# EAGLE design DavidHouseBusinessCardv1 (EAGLE 9.3.1)
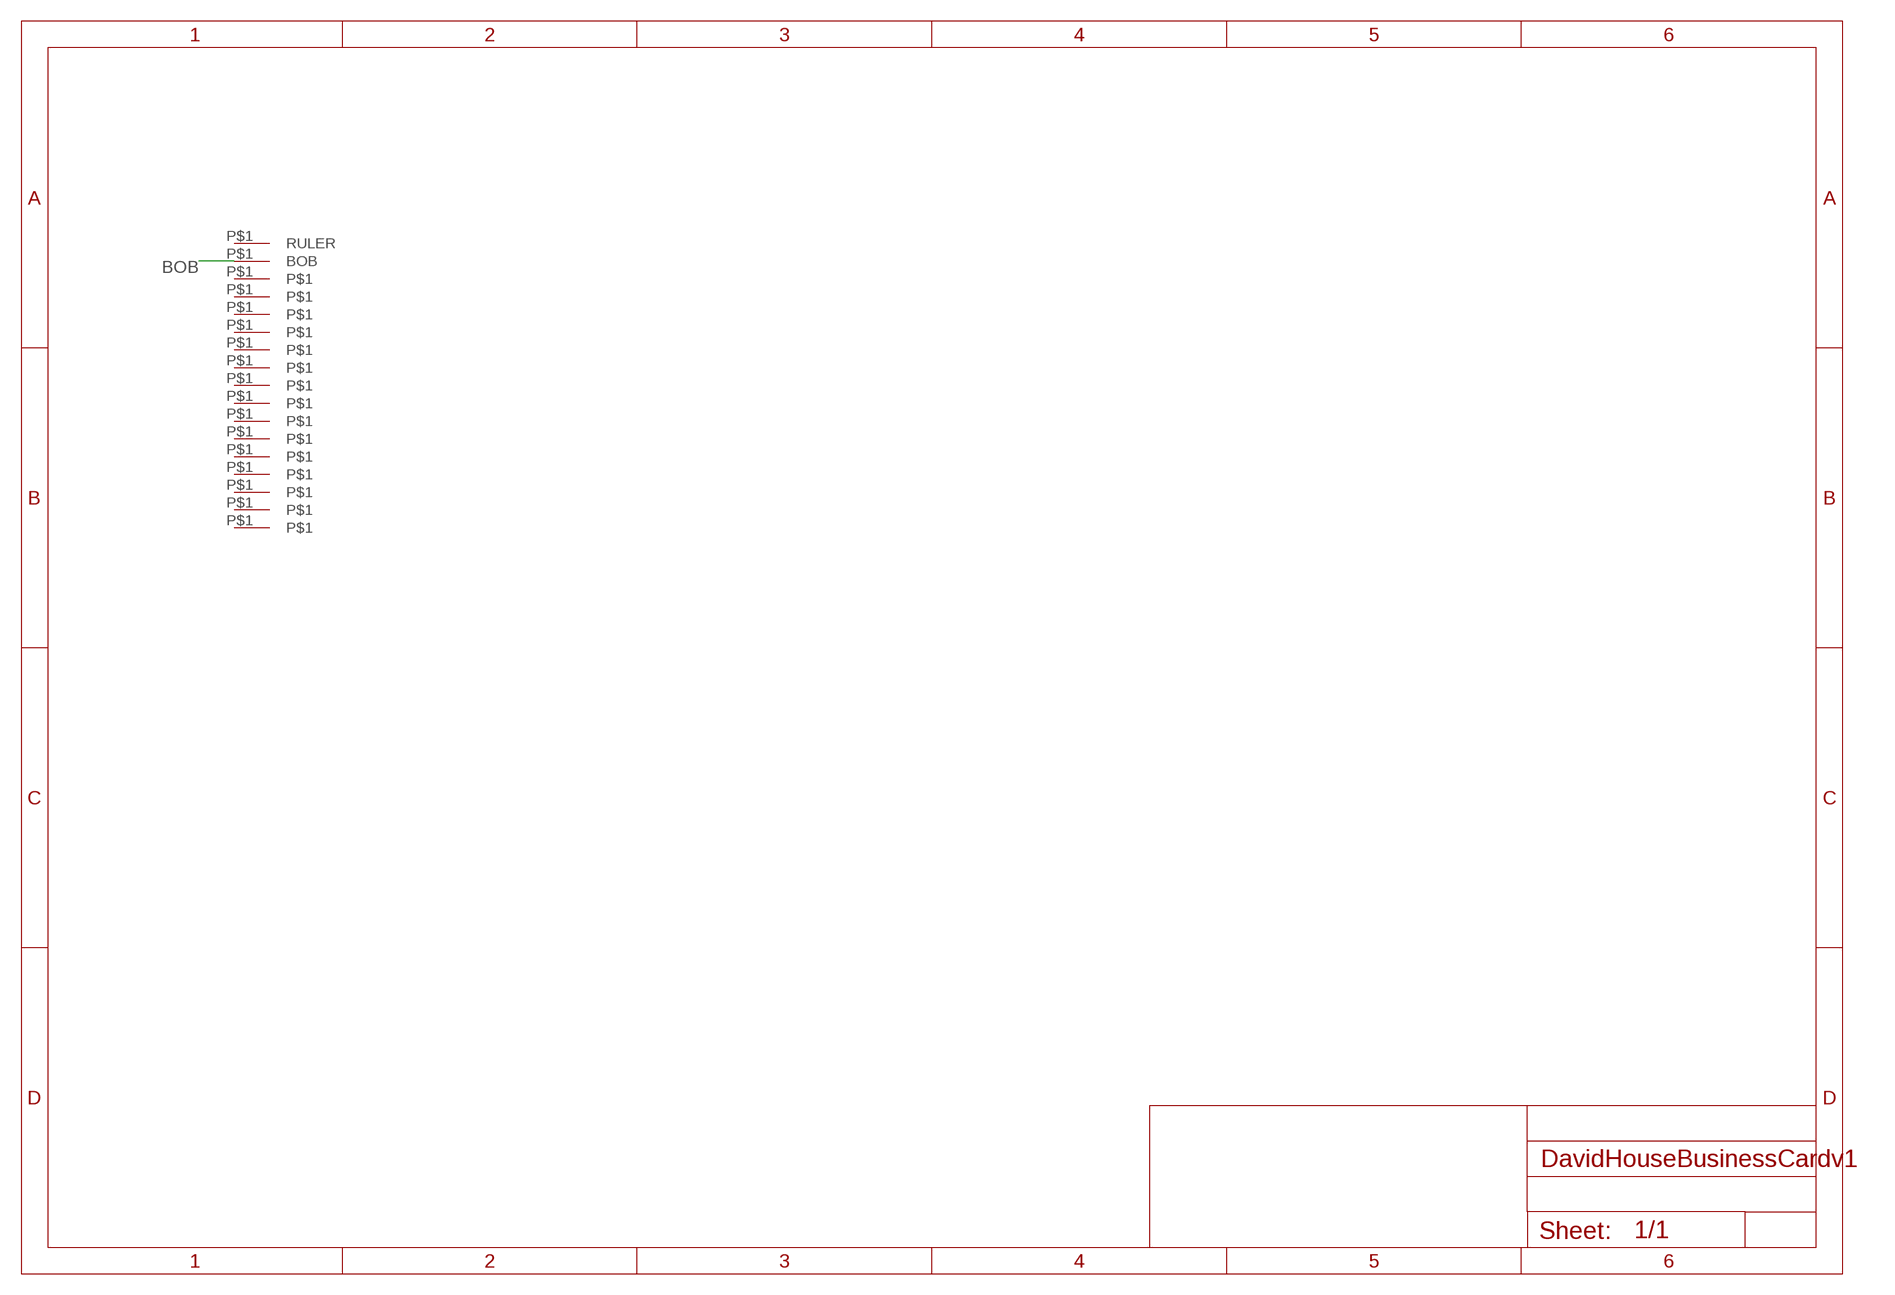
[diagram p0: schematic, sheet 1]

## Parts
U$1  EEL_LOGO  [BOB_LOGO]
U$2  LOOP_CROSS  [LOOP_CROSS]
U$3  LOOP_CROSS  [LOOP_CROSS]
U$4  LOOP_CROSS  [LOOP_CROSS]
U$5  LOOP_CROSS  [LOOP_CROSS]
U$6  LOOP_CROSS  [LOOP_CROSS]
U$7  LOOP_CROSS  [LOOP_CROSS]
U$8  LOOP_CROSS  [LOOP_CROSS]
U$9  LOOP_CROSS  [LOOP_CROSS]
U$10  LOOP_CROSS  [LOOP_CROSS]
U$11  LOOP_CROSS  [LOOP_CROSS]
U$12  LOOP_CROSS  [LOOP_CROSS]
U$13  LOOP_CROSS  [LOOP_CROSS]
U$14  LOOP_CROSS  [LOOP_CROSS]
U$15  LOOP_CROSS  [LOOP_CROSS]
U$16  LOOP_CROSS  [LOOP_CROSS]
U$17  RULER  [RULER]

## Nets
BOB: U$1.P$1(BOB)
Unconnected: U$2.P$1 U$3.P$1 U$4.P$1 U$5.P$1 U$6.P$1 U$7.P$1 U$8.P$1 U$9.P$1 U$10.P$1 U$11.P$1 U$12.P$1 U$13.P$1 U$14.P$1 U$15.P$1 U$16.P$1 U$17.P$1(RULER)

## Library data of the parts
U$1 = EEL:EEL_LOGO
U$2-U$16 = EEL:LOOP_CROSS
U$17 = EEL:RULER

## Board
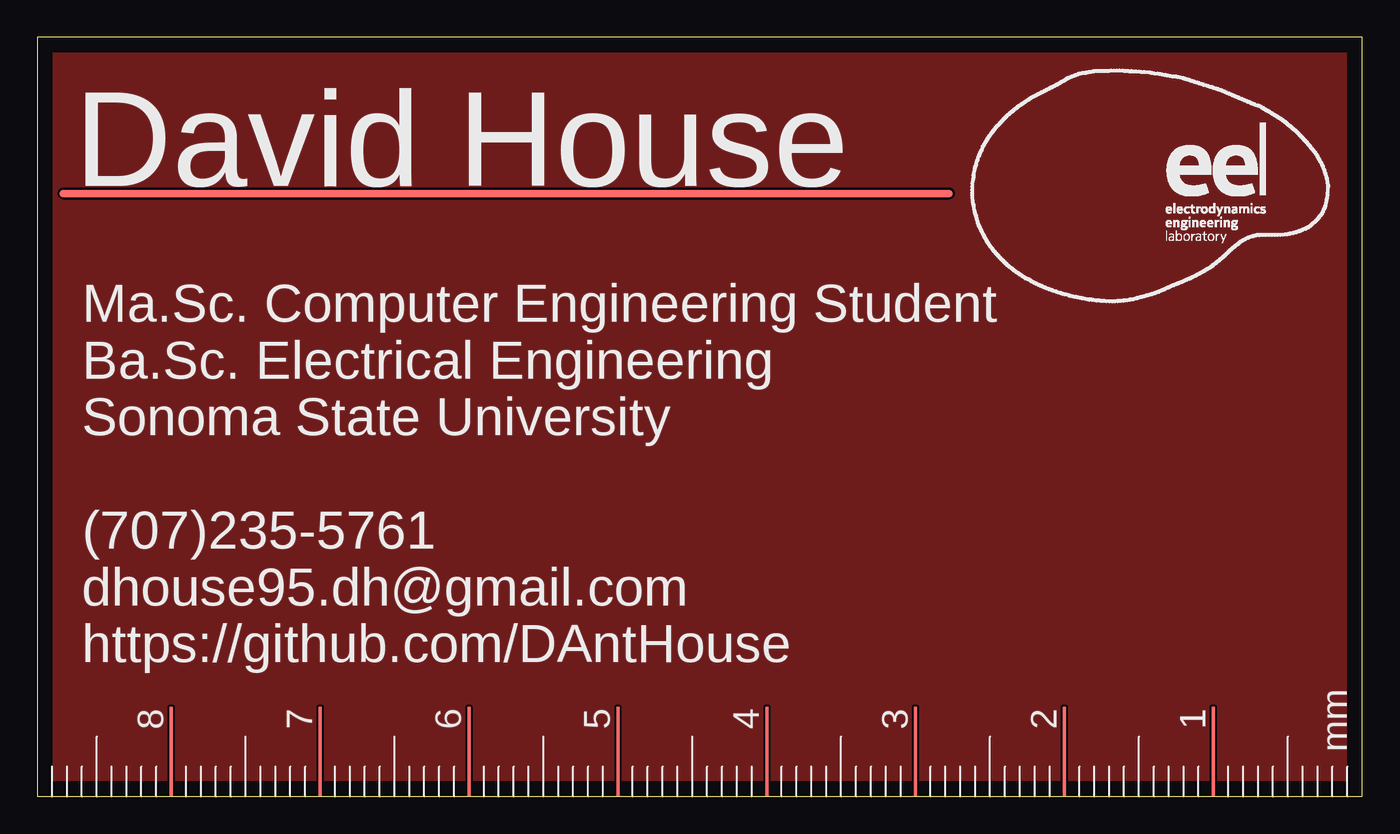
[diagram p1: board, top side]
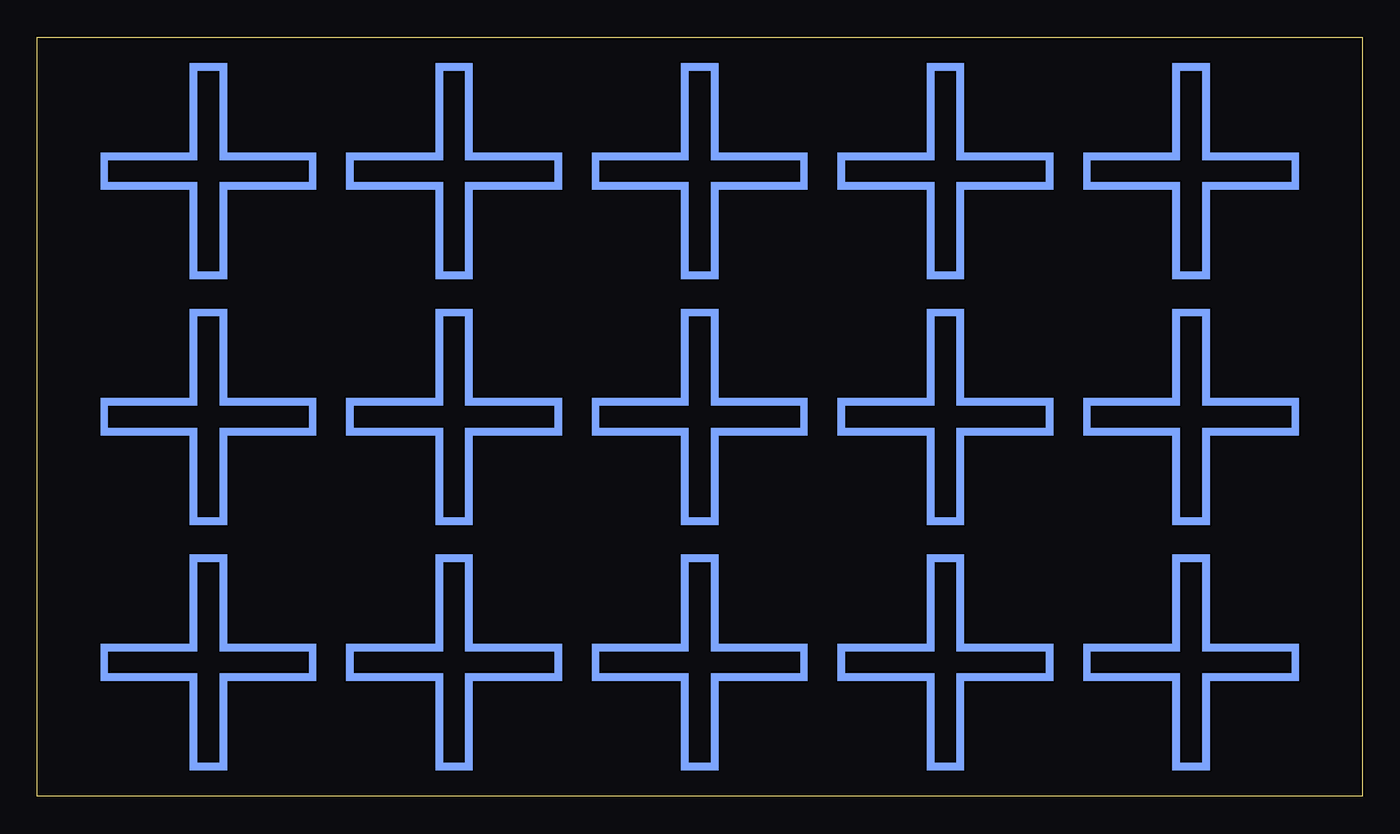
[diagram p2: board, bottom side, seen from below]

Size 89 x 51 mm. Coordinates in mm from the lower left corner, seen from the top.
Outline: 0,0 89,0 89,51 0,51 0,0
Copper layers (1*16): Top 0.035mm / dielectric 1.5mm / Bottom 0.035mm
Design rules "default": minimum track width 6mil, minimum drill 0.35mm, track to track 6mil, track to pad 6mil, pad to pad 6mil, via to via 6mil, smd to smd 6mil, copper to edge 40mil, drill to drill 6mil, minimum pad ring 10mil, minimum via ring 8mil, stop-mask expansion 4mil, vias tented up to drill 0mil, thermal gap 10mil

### Footprints (pad centres in the part's own frame; a part is rotated, then mirrored left to right if it is on the bottom)
BOB_LOGO = smd 60 x 0.5: P$1 -31,8
LOOP_CROSS = smd 0.5 x 6.5: P$1 -1,-4; P$4 -1,4; P$7 1,-4; P$8 1,4 | smd 6.5 x 0.5: P$2 4,-1; P$3 -4,-1; P$5 4,1; P$6 -4,1 | smd 0.5 x 2: P$9 -7,0; P$10 7,0 | smd 2 x 0.5: P$11 0,-7; P$12 0,7
RULER = smd 0.2 x 6: P$1 79,3; P$2 69,3; P$3 59,3; P$4 49,3; P$5 39,3; P$6 29,3; P$7 19,3; P$8 9,3

### Placement (x,y rotation side)
U$1  62.5,32.5 0 top
U$2  11.5,9 0 bottom
U$3  11.5,25.5 0 bottom
U$4  77.5,25.5 0 bottom
U$5  28,9 0 bottom
U$6  44.5,9 0 bottom
U$7  61,25.5 0 bottom
U$8  44.5,25.5 0 bottom
U$9  77.5,9 0 bottom
U$10  61,9 0 bottom
U$11  28,25.5 0 bottom
U$12  28,42 0 bottom
U$13  44.5,42 0 bottom
U$14  61,42 0 bottom
U$15  11.5,42 0 bottom
U$16  77.5,42 0 bottom
U$17  0,0 0 top

### Tracks (layer width: path | path; a pad name or v marks a point on that pad's centre or on a via)
GND
  pour Top: 0,0 89,0 89,51 0,51

### Text on the board
tPlace: David House | Ma.Sc. Computer Engineering Student / Ba.Sc. Electrical Engineering / Sonoma State University / / (707)235-5761 / dhouse95.dh@gmail.com / https://github.com/DAntHouse | 8 | 7 | 6 | 5 | 4 | 3 | 2 | 1 | mm